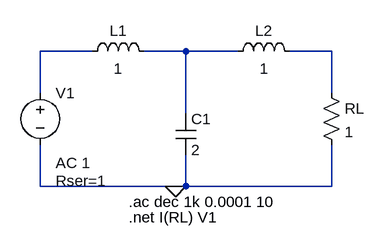
[diagram p0: schematic EJ1.asc]
EJ1.asc, the LTspice schematic file:
Version 4
SHEET 1 880 680
WIRE 32 96 -48 96
WIRE 176 96 112 96
WIRE 256 96 176 96
WIRE 400 96 336 96
WIRE -48 160 -48 96
WIRE 400 160 400 96
WIRE 176 192 176 96
WIRE -48 304 -48 240
WIRE 160 304 -48 304
WIRE 176 304 176 256
WIRE 176 304 160 304
WIRE 400 304 400 240
WIRE 400 304 176 304
FLAG 160 304 0
SYMBOL ind 16 112 R270
WINDOW 0 32 56 VTop 2
WINDOW 3 5 56 VBottom 2
SYMATTR InstName L1
SYMATTR Value 1
SYMBOL ind 240 112 R270
WINDOW 0 32 56 VTop 2
WINDOW 3 5 56 VBottom 2
SYMATTR InstName L2
SYMATTR Value 1
SYMBOL cap 160 192 R0
SYMATTR InstName C1
SYMATTR Value 2
SYMBOL res 384 144 R0
SYMATTR InstName RL
SYMATTR Value 1
SYMBOL voltage -48 144 R0
WINDOW 123 24 124 Left 2
WINDOW 39 24 152 Left 2
SYMATTR InstName V1
SYMATTR Value ""
SYMATTR Value2 AC 1
SYMATTR SpiceLine Rser=1
TEXT 88 328 Left 2 !.ac dec 1k 0.0001 10
TEXT 88 352 Left 2 !.net I(RL) V1

The netlist it stands for:
* EJ1.asc
L1 N001 N002 1
L2 N002 N003 1
C1 N002 0 2
RL N003 0 1
V1 N001 0 AC 1 Rser=1
.ac dec 1k 0.0001 10
.net I(RL) V1
.backanno
.end